# Altium schematic sheet Chrg_Discharge_cntrl.SchDoc: Charge/Discharge Protection
size B; Date: 04/05/2025; Author: John Ulm; DrawnBy: John Ulm; Organization: ORGANIZATION; Address1: ADDRESS 1; Address2: ADDRESS 2; Address3: ADDRESS 3; Address4: ADDRESS 4; Revision: -; SheetNumber: 5; SheetTotal: 8; ENG_APP_DATE: --/--/--; DSN_APP_DATE: --/--/--; CHK_APP_DATE: --/--/--
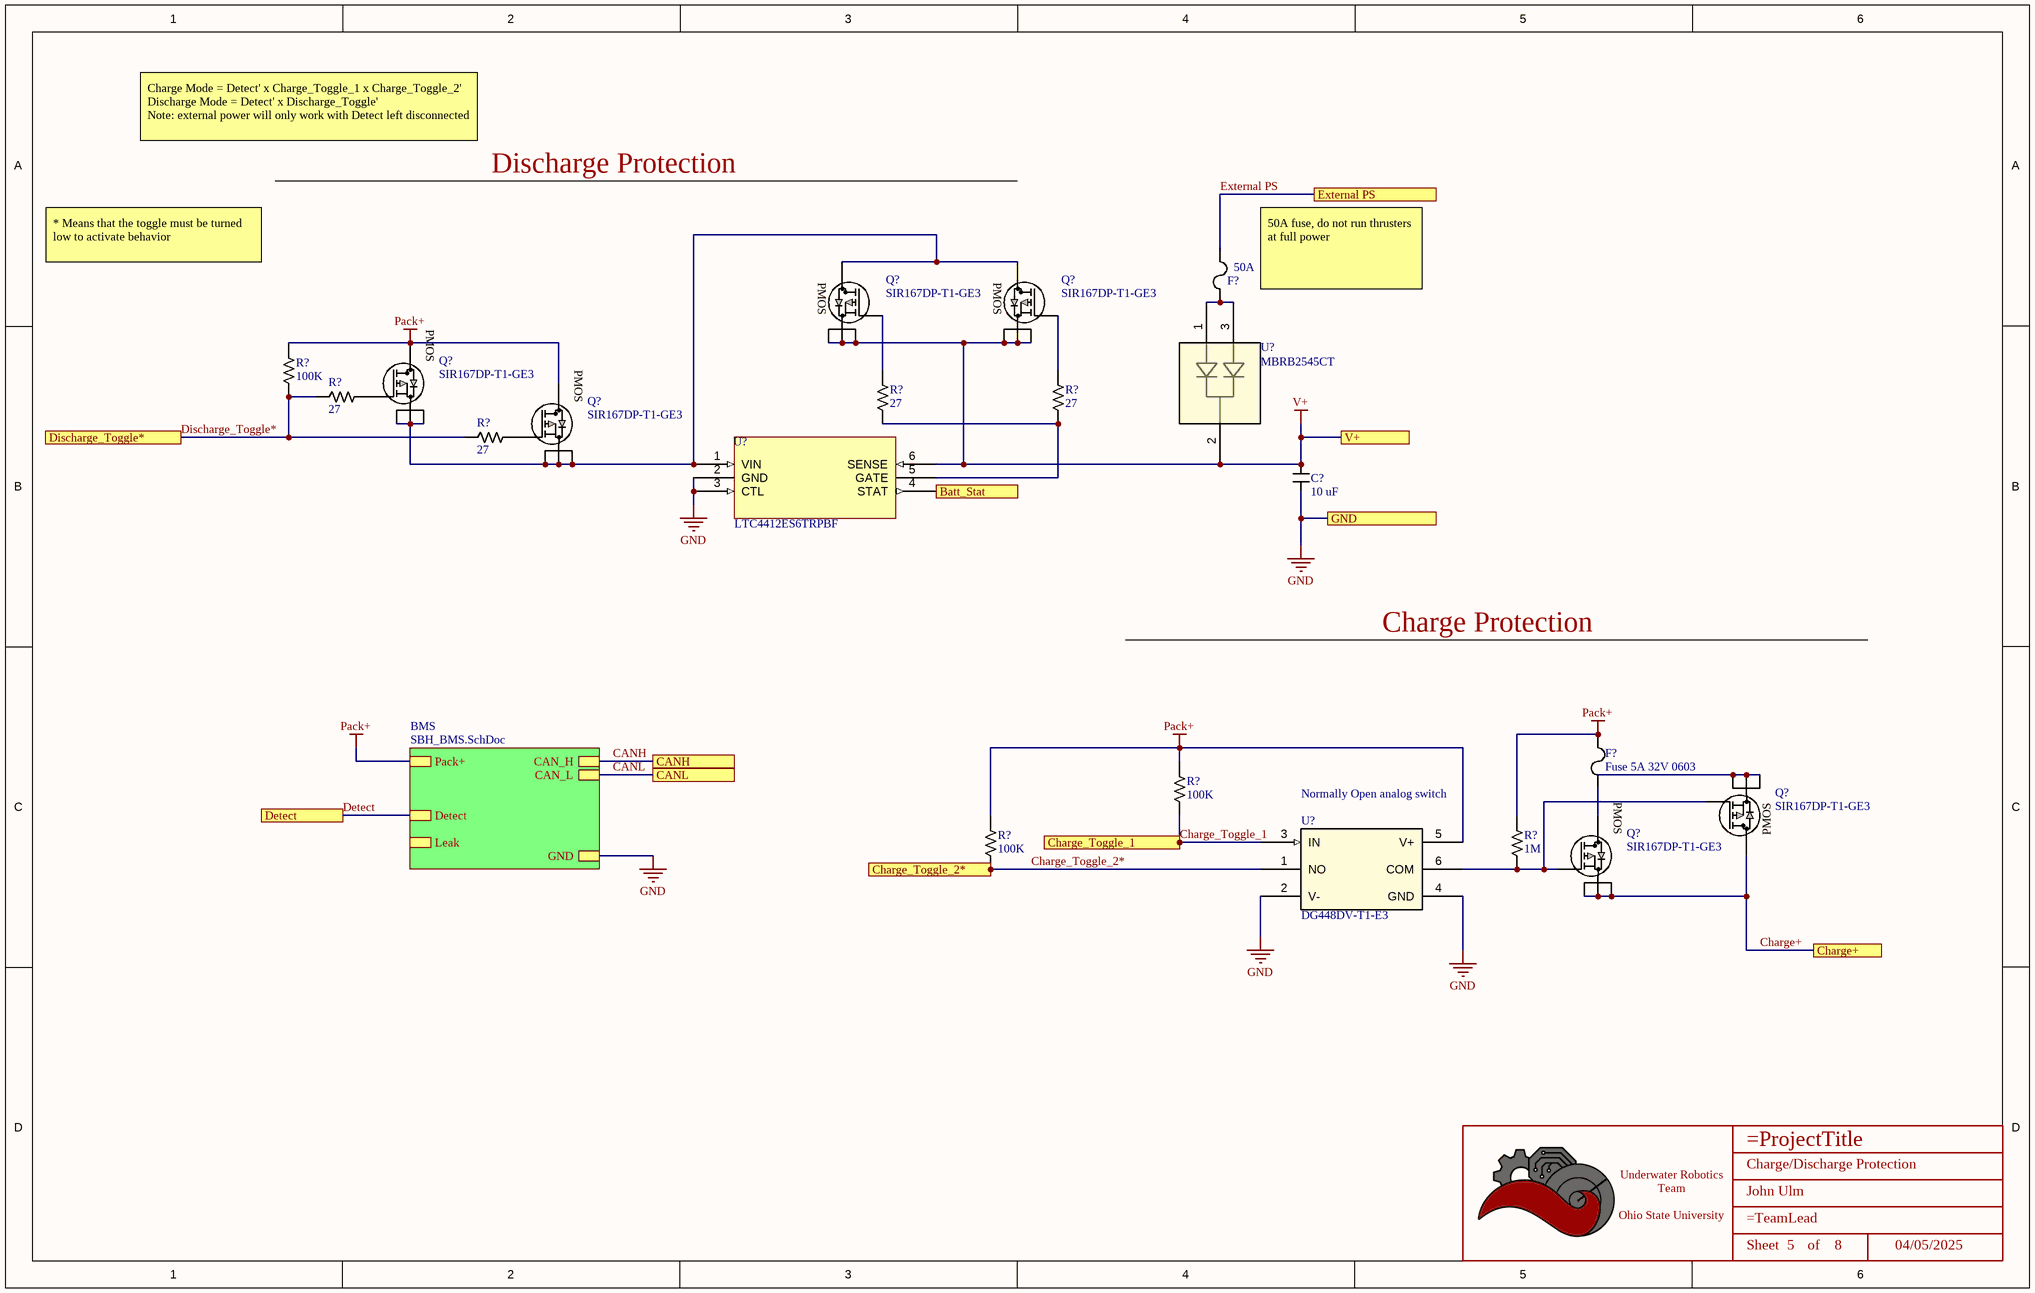
[diagram p0: Chrg_Discharge_cntrl.SchDoc]

## Parts
(Parts that share a designator on the sheet are numbered #1, #2 ... from top to bottom, then left to right.)
*  Title_Block  [LOGO]  (value not drawn)  (graphical)
C?  Value (uF): 10 uF  [CAPACITOR_1206]  (hidden comment: 10uF Ceramic 25V)
F?#1  Current Rating: 50A  [UHS]  (hidden comment: 3-140-167)
F?#2  Fuse 5A 32V 0603  [2-SMD Fuse 0603]
Q?#1  SIR167DP-T1-GE3  [MOSFET_7DP-T1-GE3_VIS]
Q?#2  SIR167DP-T1-GE3  [MOSFET_7DP-T1-GE3_VIS]
Q?#3  SIR167DP-T1-GE3  [MOSFET_7DP-T1-GE3_VIS]
Q?#4  SIR167DP-T1-GE3  [MOSFET_7DP-T1-GE3_VIS]
Q?#5  SIR167DP-T1-GE3  [MOSFET_7DP-T1-GE3_VIS]
Q?#6  SIR167DP-T1-GE3  [MOSFET_7DP-T1-GE3_VIS]
R?#1  Value  (Ohms): 100K  [RESISTOR_0603]  (hidden comment: 100k Ohm 5% 1/8W)
R?#2  Value  (Ohms): 27  [RESISTOR_0603]  (hidden comment: 27 Ohm 5% 1/8W)
R?#3  Value  (Ohms): 27  [RESISTOR_0603]  (hidden comment: 27 Ohm 5% 1/8W)
R?#4  Value  (Ohms): 27  [RESISTOR_0603]  (hidden comment: 27 Ohm 5% 1/8W)
R?#5  Value  (Ohms): 27  [RESISTOR_0603]  (hidden comment: 27 Ohm 5% 1/8W)
R?#6  Value  (Ohms): 100K  [RESISTOR_0603]  (hidden comment: 100k Ohm 5% 1/8W)
R?#7  Value  (Ohms): 100K  [RESISTOR_0603]  (hidden comment: 100k Ohm 5% 1/8W)
R?#8  1M  [RESISTOR_0603]
U?#1  MBRB2545CT  [D2PAK_VIS]
U?#2  LTC4412ES6TRPBF  [TSOT-23_S6]
U?#3  DG448DV-T1-E3  [TSOP6_DG_VIS-M]

## Sub-sheets
BMS = SBH_BMS.SchDoc: Pack+, GND, Detect, Leak, CAN_H, CAN_L

## Ports
Batt_Stat, CANH, CANL, Charge+, Charge_Toggle_1, Charge_Toggle_2*, Detect, Discharge_Toggle*, External PS, GND, V+

## Nets
GND: C?.2 U?#2.2(GND) U?#2.3(CTL) U?#3.2(V-) U?#3.4(GND) ; port GND, sheet BMS/GND
Pack+: F?#2.2 Q?#3.D Q?#4.D R?#1.1 R?#6.1 R?#7.1 R?#8.1 U?#3.5(V+) ; sheet BMS/Pack+
V+: C?.1 Q?#1.1(S) Q?#1.2(S) Q?#1.3(S) Q?#2.1(S) Q?#2.2(S) Q?#2.3(S) U?#1.2 U?#2.6(SENSE) ; port V+
Batt_Stat: U?#2.4(STAT) ; port Batt_Stat
CANH: port CANH, sheet BMS/CAN_H
CANL: port CANL, sheet BMS/CAN_L
Charge+: Q?#5.D Q?#6.1(S) Q?#6.2(S) Q?#6.3(S) ; port Charge+
Charge_Toggle_1: R?#6.2 U?#3.3(IN) ; port Charge_Toggle_1
Charge_Toggle_2*: R?#7.2 U?#3.1(NO) ; port Charge_Toggle_2*
Detect: port Detect, sheet BMS/Detect
Discharge_Toggle*: R?#1.2 R?#2.2 R?#5.2 ; port Discharge_Toggle*
External PS: F?#1.2 ; port External PS
NetF?#1_1: F?#1.1 U?#1.1 U?#1.3
NetF?#2_1: F?#2.1 Q?#6.D
NetQ?#1_4: Q?#1.4(G) R?#3.1
NetQ?#1_D: Q?#1.D Q?#2.D Q?#3.1(S) Q?#3.2(S) Q?#3.3(S) Q?#4.1(S) Q?#4.2(S) Q?#4.3(S) U?#2.1(VIN)
NetQ?#2_4: Q?#2.4(G) R?#4.1
NetQ?#3_4: Q?#3.4(G) R?#2.1
NetQ?#4_4: Q?#4.4(G) R?#5.1
NetQ?#5_1: Q?#5.1(S) Q?#5.2(S) Q?#5.3(S)
NetQ?#5_4: Q?#5.4(G) Q?#6.4(G) R?#8.2 U?#3.6(COM)
NetR?#3_2: R?#3.2 R?#4.2 U?#2.5(GATE)

## Notes on the sheet
- Charge Mode = Detect' x Charge_Toggle_1 x Charge_Toggle_2'  Discharge Mode = Detect' x Discharge_Toggle'                         Note: external power will only work with Detect left disconnected
- Discharge Protection
- * Means that the toggle must be turned low to activate behavior
- 50A fuse, do not run thrusters at full power
- Charge Protection
- Normally Open analog switch
- DWG. NO.
- REV.
- SHT.
- THIS DOCUMENT AND THE DATA DISCLOSED HEREIN OR HEREWITH IS THE PROPERTY OF ALTIUM LIMITED AND MAY BE FREELY DISTRIBUTED IN WHOLE. NO RIGHTS ARE RESERVED OR EXPRESS OR IMPLIED WARANTEE GIVEN.
- REVISION
- DESCRIPTION
- DATE
- APPROVED
- ENG:
- APPROVALS
- PROJECT
- DSN:
- CHK:
- REFERENCE DOCUMENTS
- PROJECT REVISION:
- TITLE
- DOCUMENT REVISION:
- DESIGN ITEM:
- BOM:
- FAB DWG:
- PCB DWG:
- ASSY DWG:
- SCALE:
- SIZE
- B
- CAGE CODE
- FILE NAME
- DWG NO.
- SHEET
- OF
- REV
- (in symbol SIR167DP-T1-GE3) PMOS
- (in symbol Title_Block) Underwater Robotics Team / Ohio State University; Sheet; of

## Library data of the parts
* = Title_Block: UWRT Schematic Title Block Template / Created June 2021, Dylan Trainor
C? = CAPACITOR_10uF_1206: Cap 10uF 25V +/-10% / Ceramic 1206; Made By: Robert Pafford; Tolerance: +/- 10%; Voltage: 25V; Supplier 1: Digi-Key; Supplier Part Number 1: 1276-1804-6-ND
F?#1 = UHS Fuse 50A: 50 A AC 32 V DC Fuse Board Mount (Cartridge Style Excluded) Surface Mount 2-SMD, J-Lead; Mfr_Name: SCHURTER Inc.; Voltage Rating: 32VDC; Supplier 1: Digikey; Supplier Part Number 1: 486-3-140-167-ND; Manufacturer_Part_Number: 3-140-167; Response Time: *
F?#2 = ERB-RE5R00V: Pansonic | 32V | 5A | 0603 | Fast Blow; Mfr_Name: Panasonic; Breaking Capacity: 150A; Manufacturer_Part_Number: ERB-RE5R00V; Current Rating: 5A; Voltage Rating: 32V; Response Time: Fast Blow; Package: 1206; Created By: Robert Pafford; Supplier 1: Digi-Key; Supplier Part Number 1: P15125CT-ND
Q?#1-Q?#6 = SIR167DP-T1-GE3: P-Channel 30 V 60A (Tc) 65.8W (Tc) Surface Mount PowerPAK® SO-8; Mfr_Name: Vishay; Type: DEV; Copyright: Copyright (C) 2022 Ultra Librarian. All rights reserved.; Manufacturer_Part_Number: SIR167DP-T1-GE3; RefDes: RefDes; Supplier 1: Mouser; Supplier Part Number 1: 78-SIR167DP-T1-GE3
R?#1 R?#6 R?#7 = RESISTOR_100K_0603: RES 100k OHM 5% 1/10W 0603; Tolerance: +/- 5%; Made By: Flip B; ComponentLink1Description: Datasheet; ComponentLink1URL: https://www.bourns.com/docs/product-datasheets/CRxxxxx.pdf; Wattage: 1/10W; Supplier: Digikey; Digikey Part Numer: CR0603-JW-104ELFTR-ND; Supplier 1: Digi-Key; Supplier Part Number 1: CR0603-JW-104ELFCT-ND
R?#2-R?#5 = RESISTOR_27_0603: RES 27 OHM 5% 1/8W 0603; Tolerance: +/- 5%; Made By: Robert Pafford; ComponentLink1Description: Datasheet; ComponentLink1URL: https://www.bourns.com/docs/product-datasheets/CRxxxxx.pdf; Wattage: 1/8W; Supplier: Digikey; Digikey Part Numer: CR0603-JW-104ELFTR-ND; Supplier 1: Digi-Key; Supplier Part Number 1: 2019-RK73B1JTTD270JCT-ND
R?#8 = RESISTOR_1M_0603: RES 1M OHM 1/8W 0603; Tolerance: +/- 5%; Made By: Robert Pafford; ComponentLink1Description: Datasheet; ComponentLink1URL: https://www.bourns.com/docs/product-datasheets/CRxxxxx.pdf; Wattage: 1/8W; Supplier: Digikey; Digikey Part Numer: CR0603-JW-104ELFTR-ND; Supplier 1: Digi-Key; Supplier Part Number 1: RMCF0603JT1M00CT-ND; Value  (Ohms): 1M
U?#1 = MBRB2545CT: Diode Array 1 Pair Common Cathode 45 V Surface Mount TO-263-3, D²Pak (2 Leads + Tab), TO-263AB; Mfr_Name: Vishay; Copyright: Copyright (C) 2023 Ultra Librarian. All rights reserved.; Manufacturer_Part_Number: MBRB2545CT; RefDes: RefDes; Type: DEV; ComponentLink1Description: Supplier Link; ComponentLink1URL: https://www.digikey.com/en/products/detail/smc-diode-solutions/MBRB2545CT/6022901
U?#2 = LTC4412ES6TRPBF: OR Controller Source Selector Switch P-Channel 2:1 TSOT-23-6; MP: LTC4412ES6#TRPBF; MF: Analog Devices; Price: None; Availability: Good; Mouser-Purchase-URL: https://snapeda.com/shop?store=Mouser&id=4343773; Arrow_Europe-Purchase-URL: https://snapeda.com/shop?store=Arrow+Europe&id=4343773; DigiKey-Purchase-URL: https://snapeda.com/shop?store=DigiKey&id=4343773; Package: SOT-23-6 Analog Devices; SnapEDA_Link: https://www.snapeda.com/parts/LTC4412ES6%23TRPBF/Analog%20Devices/view-part/4343773/?ref=snap; Value: *; Check_prices: https://www.snapeda.com/parts/LTC4412ES6%23TRPBF/Analog%20Devices/view-part/4343773/?ref=eda; Supplier 1: Mouser; Supplier Part Number 1: 584-LTC4412ES6#TRPBF
U?#3 = DG448DV-T1-E3: IC SWITCH SPST-NOX1 25OHM 6TSOP; Mfr_Name: Vishay; Copyright: Copyright (C) 2024 Ultra Librarian. All rights reserved.; Manufacturer_Part_Number: DG448DV-T1-E3; RefDes: RefDes; Type: DEV; Supplier 1: Mouser; Supplier Part Number 1: 781-DG448DV-E3